# EAGLE design ADDER_auto (EAGLE 9.6.2)
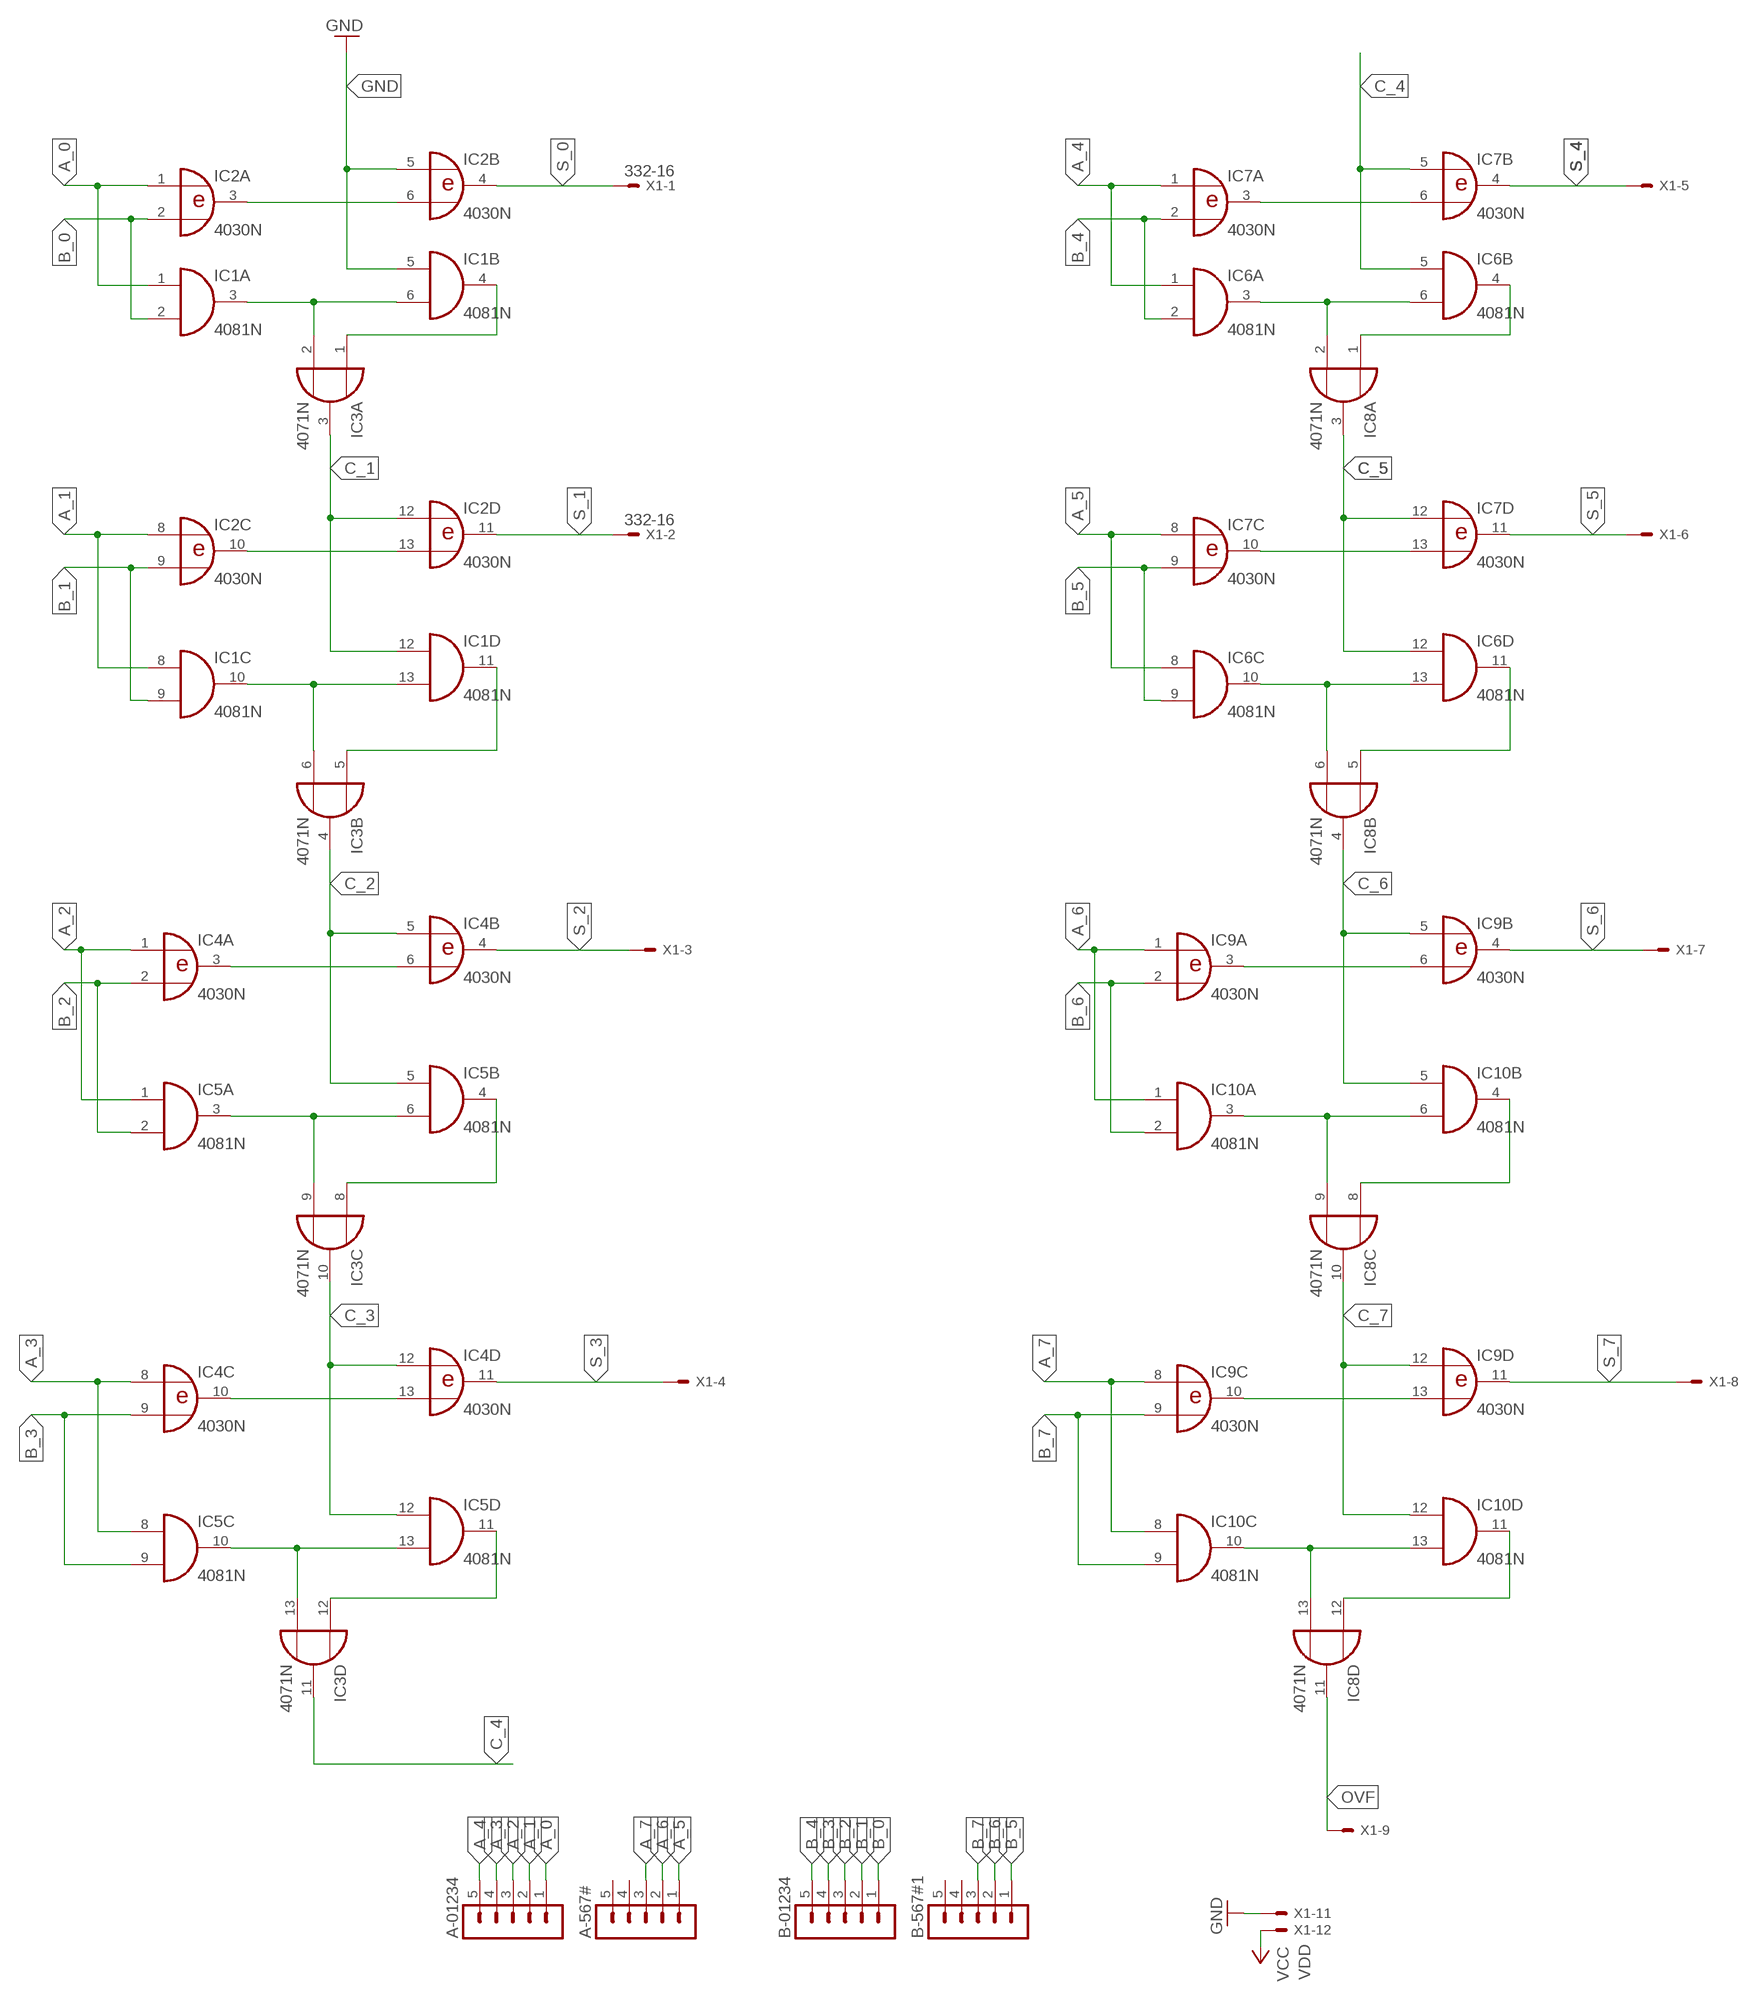
[diagram p0: schematic, sheet 1]

## Parts
A-567#  MA05-1  [MA05-1]
A-01234  MA05-1  [MA05-1]
B-567#1  MA05-1  [MA05-1]
B-01234  MA05-1  [MA05-1]
IC1  4081N  [DIL14]
IC2  4030N  [DIL14]
IC3  4071N  [DIL14]
IC4  4030N  [DIL14]
IC5  4081N  [DIL14]
IC6  4081N  [DIL14]
IC7  4030N  [DIL14]
IC8  4071N  [DIL14]
IC9  4030N  [DIL14]
IC10  4081N  [DIL14]
X1  332-16  [332-16]

## Nets
A_0: A-01234.1 IC1.1(A:I0) IC2.1(A:I0)
A_1: A-01234.2 IC1.8(C:I0) IC2.8(C:I0)
A_2: A-01234.3 IC4.1(A:I0) IC5.1(A:I0)
A_3: A-01234.4 IC4.8(C:I0) IC5.8(C:I0)
A_4: A-01234.5 IC6.1(A:I0) IC7.1(A:I0)
A_5: A-567#.1 IC6.8(C:I0) IC7.8(C:I0)
A_6: A-567#.2 IC9.1(A:I0) IC10.1(A:I0)
A_7: A-567#.3 IC9.8(C:I0) IC10.8(C:I0)
B_0: B-01234.1 IC1.2(A:I1) IC2.2(A:I1)
B_1: B-01234.2 IC1.9(C:I1) IC2.9(C:I1)
B_2: B-01234.3 IC4.2(A:I1) IC5.2(A:I1)
B_3: B-01234.4 IC4.9(C:I1) IC5.9(C:I1)
B_4: B-01234.5 IC6.2(A:I1) IC7.2(A:I1)
B_5: B-567#1.1 IC6.9(C:I1) IC7.9(C:I1)
B_6: B-567#1.2 IC9.2(A:I1) IC10.2(A:I1)
B_7: B-567#1.3 IC9.9(C:I1) IC10.9(C:I1)
C_1: IC1.12(D:I0) IC2.12(D:I0) IC3.3(A:O)
C_2: IC3.4(B:O) IC4.5(B:I0) IC5.5(B:I0)
C_3: IC3.10(C:O) IC4.12(D:I0) IC5.12(D:I0)
C_4: IC3.11(D:O) IC6.5(B:I0) IC7.5(B:I0)
C_5: IC6.12(D:I0) IC7.12(D:I0) IC8.3(A:O)
C_6: IC8.4(B:O) IC9.5(B:I0) IC10.5(B:I0)
C_7: IC8.10(C:O) IC9.12(D:I0) IC10.12(D:I0)
GND: IC1.5(B:I0) IC2.5(B:I0) X1.11
N$1: IC1.3(A:O) IC1.6(B:I1) IC3.2(A:I1)
N$2: IC1.4(B:O) IC3.1(A:I0)
N$3: IC2.10(C:O) IC2.13(D:I1)
N$4: IC4.3(A:O) IC4.6(B:I1)
N$5: IC2.3(A:O) IC2.6(B:I1)
N$6: IC1.10(C:O) IC1.13(D:I1) IC3.6(B:I1)
N$7: IC1.11(D:O) IC3.5(B:I0)
N$8: IC3.13(D:I1) IC5.10(C:O) IC5.13(D:I1)
N$9: IC3.9(C:I1) IC5.3(A:O) IC5.6(B:I1)
N$10: IC6.3(A:O) IC6.6(B:I1) IC8.2(A:I1)
N$11: IC3.12(D:I0) IC5.11(D:O)
N$12: IC4.10(C:O) IC4.13(D:I1)
N$13: IC3.8(C:I0) IC5.4(B:O)
N$14: IC6.4(B:O) IC8.1(A:I0)
N$15: IC7.3(A:O) IC7.6(B:I1)
N$16: IC7.10(C:O) IC7.13(D:I1)
N$17: IC6.10(C:O) IC6.13(D:I1) IC8.6(B:I1)
N$18: IC6.11(D:O) IC8.5(B:I0)
N$19: IC9.3(A:O) IC9.6(B:I1)
N$20: IC8.9(C:I1) IC10.3(A:O) IC10.6(B:I1)
N$21: IC8.8(C:I0) IC10.4(B:O)
N$22: IC8.13(D:I1) IC10.10(C:O) IC10.13(D:I1)
N$23: IC9.10(C:O) IC9.13(D:I1)
N$24: IC8.12(D:I0) IC10.11(D:O)
OVF: IC8.11(D:O) X1.9
S_0: IC2.4(B:O) X1.1
S_1: IC2.11(D:O) X1.2
S_2: IC4.4(B:O) X1.3
S_3: IC4.11(D:O) X1.4
S_4: IC7.4(B:O) X1.5
S_5: IC7.11(D:O) X1.6
S_6: IC9.4(B:O) X1.7
S_7: IC9.11(D:O) X1.8
VDD: X1.12 ; supply symbol labelled VCC
Unconnected: A-567#.4 A-567#.5 B-567#1.4 B-567#1.5 X1.10 X1.13 X1.14 X1.15 X1.16

## Power pins joined to a net without a drawn wire
VDD: IC1.14(P:VDD) IC2.14(P:VDD) IC3.14(P:VDD) IC4.14(P:VDD) IC5.14(P:VDD) IC6.14(P:VDD) IC7.14(P:VDD) IC8.14(P:VDD) IC9.14(P:VDD) IC10.14(P:VDD)
VSS: IC1.7(P:VSS) IC2.7(P:VSS) IC3.7(P:VSS) IC4.7(P:VSS) IC5.7(P:VSS) IC6.7(P:VSS) IC7.7(P:VSS) IC8.7(P:VSS) IC9.7(P:VSS) IC10.7(P:VSS)

## Library data of the parts
A-567# A-01234 B-567#1 B-01234 = con-lstb:MA05-1: PIN HEADER; OC_FARNELL: unknown; OC_NEWARK: unknown
IC1 IC5 IC6 IC10 = 40xx:4081: Quad 2-input AND
IC2 IC4 IC7 IC9 = 40xx:4030: Quad XOR
IC3 IC8 = 40xx:4071: Quad 2-input OR
X1 = con-garry:332-16: 16 Pin - 2mm Dual Row Source: www.mpe-connector.de / garry_shortform_2012.pdf

## Board
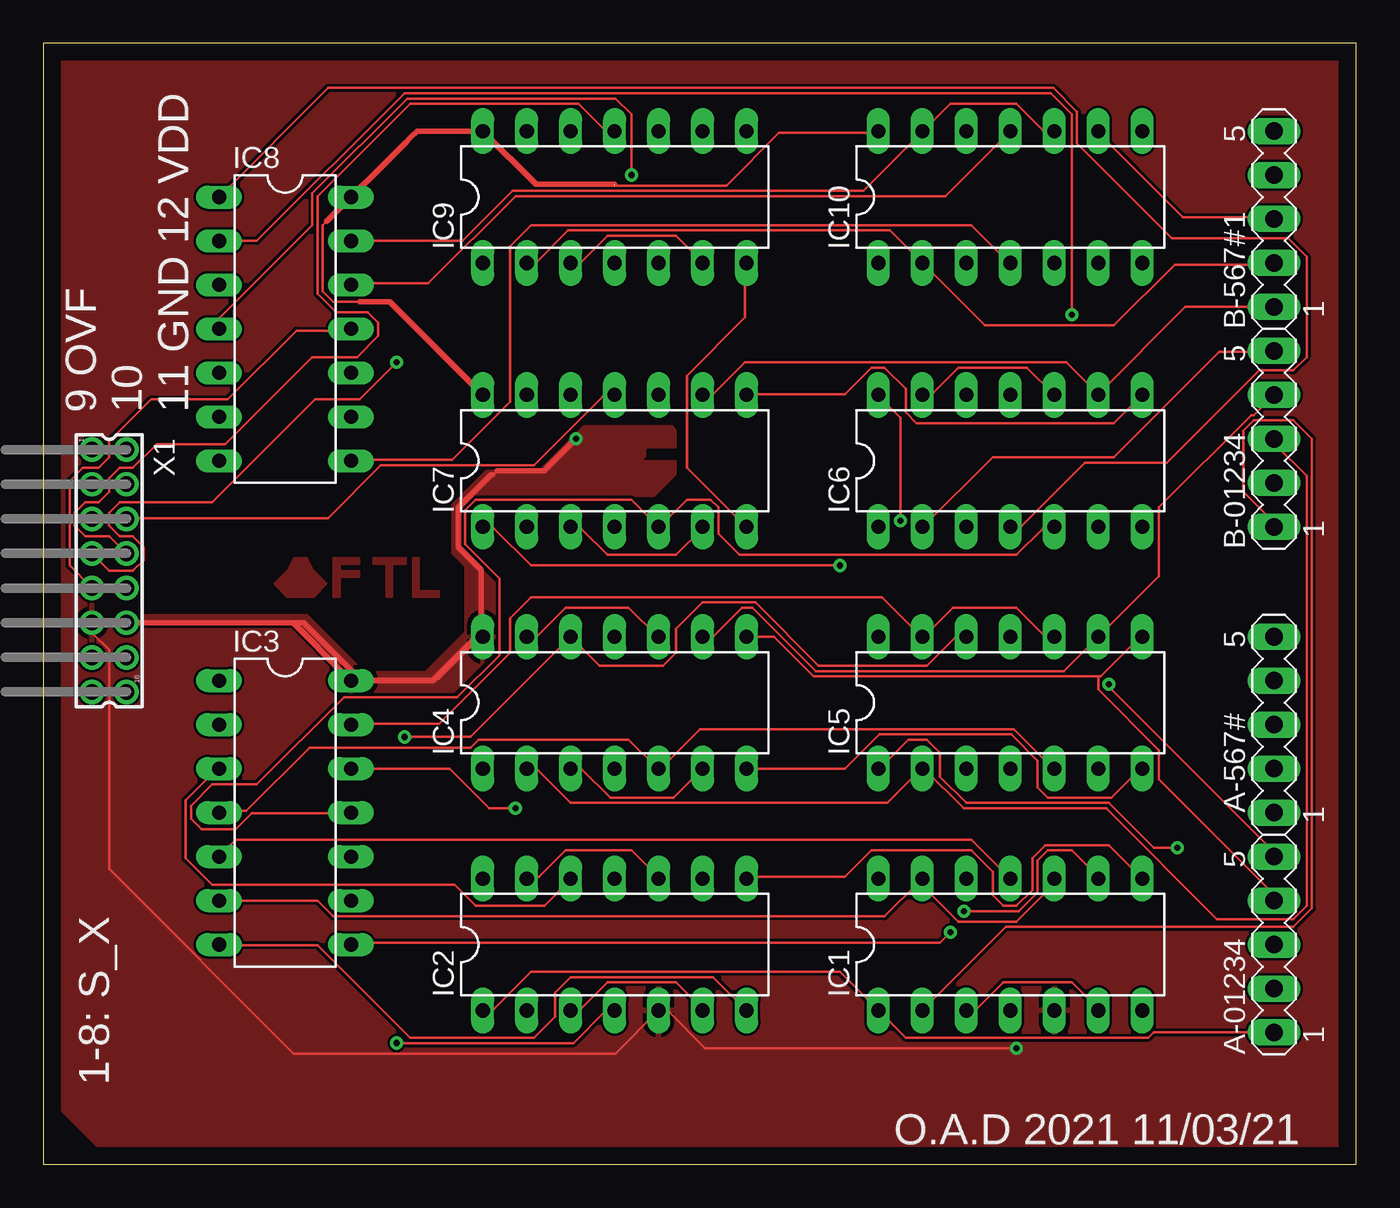
[diagram p1: board, top side]
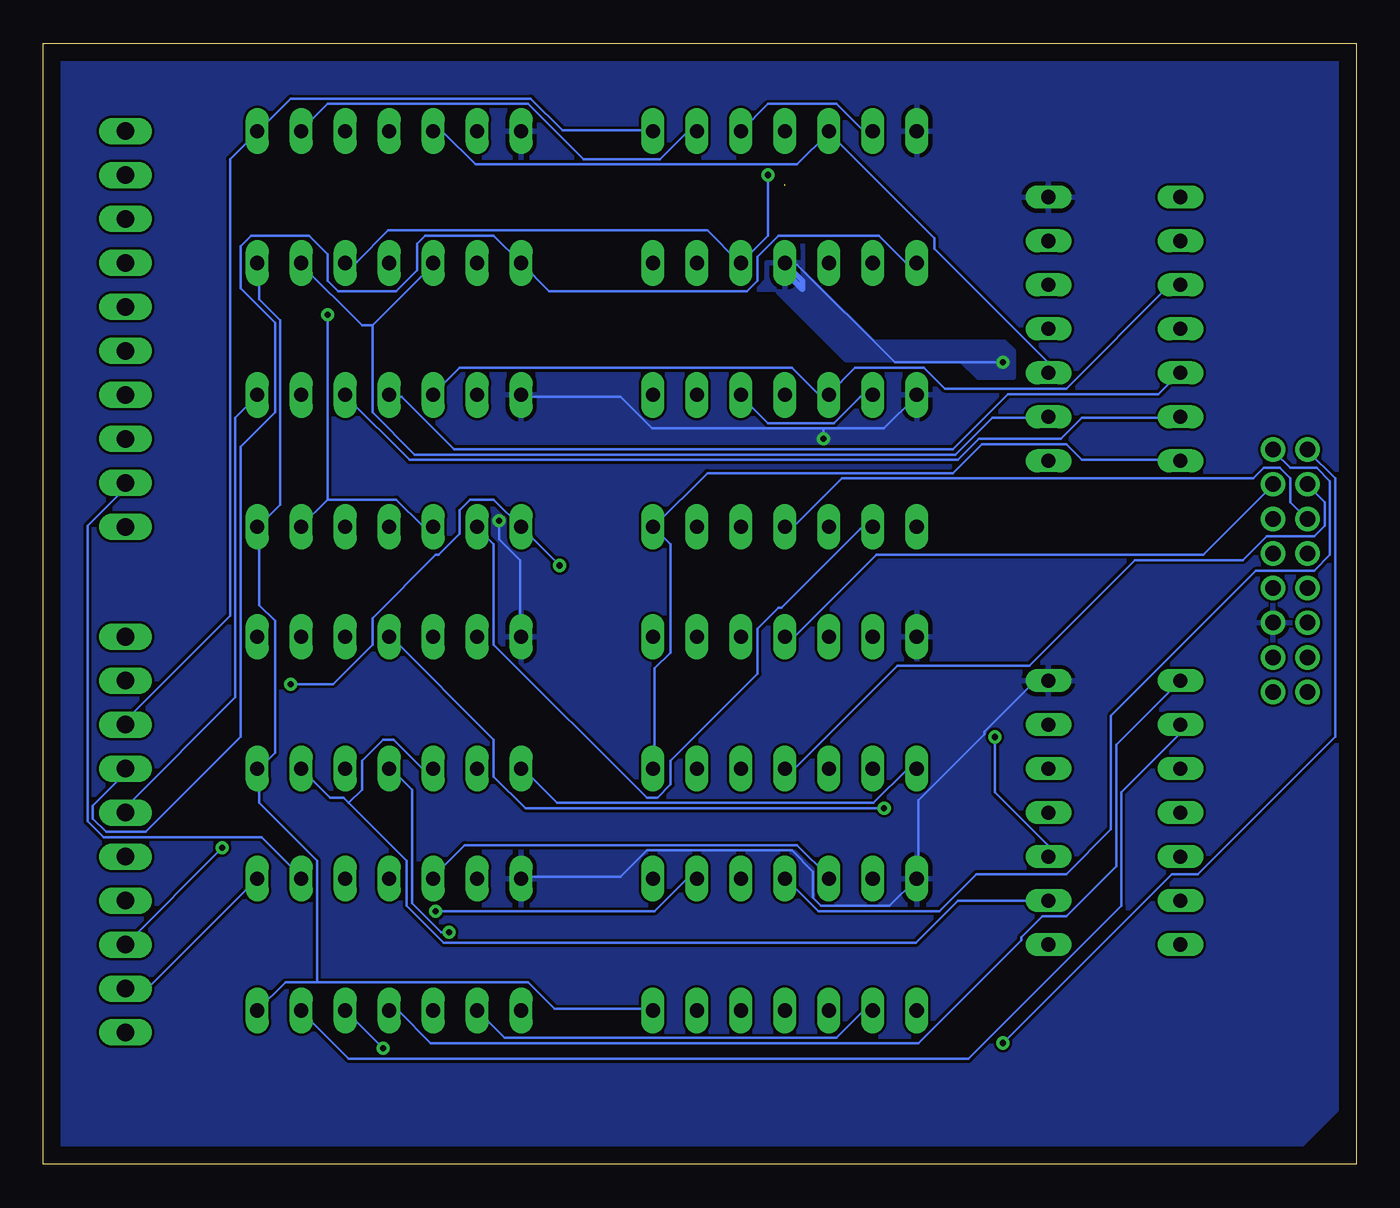
[diagram p2: board, bottom side, seen from below]

Size 75.87 x 64.76 mm. Coordinates in mm from the lower left corner, seen from the top.
Outline: 0,0 75.87,0 75.87,64.76 0,64.76 0,0
Copper layers (1*16): Top 0.035mm / dielectric 1.5mm / Bottom 0.035mm
Design rules "default": minimum track width 6mil, minimum drill 0.35mm, track to track 6mil, track to pad 6mil, pad to pad 6mil, via to via 6mil, smd to smd 6mil, copper to edge 40mil, drill to drill 6mil, minimum pad ring 10mil, minimum via ring 8mil, stop-mask expansion 4mil, vias tented up to drill 0mil, thermal gap 10mil

### Footprints (pad centres in the part's own frame; a part is rotated, then mirrored left to right if it is on the bottom)
MA05-1 = drill 1.016 long: 1 -5.08,0; 2 -2.54,0; 3 0,0; 4 2.54,0; 5 5.08,0
DIL14 = drill 0.813 long: 1 -7.62,-3.81; 2 -5.08,-3.81; 3 -2.54,-3.81; 4 0,-3.81; 5 2.54,-3.81; 6 5.08,-3.81; 7 7.62,-3.81; 8 7.62,3.81; 9 5.08,3.81; 10 2.54,3.81; 11 0,3.81; 12 -2.54,3.81; 13 -5.08,3.81; 14 -7.62,3.81
332-16 = drill 0.9 pad 1.27: 1 -7,-1; 2 -7,1; 3 -5,-1; 4 -5,1; 5 -3,-1; 6 -3,1; 7 -1,-1; 8 -1,1; 9 1,-1; 10 1,1; 11 3,-1; 12 3,1; 13 5,-1; 14 5,1; 15 7,-1; 16 7,1

### Placement (x,y rotation side)
A-567#  71.12,25.4 90 top
A-01234  71.12,12.7 90 top
B-567#1  71.12,54.61 90 top
B-01234  71.12,41.91 90 top
IC1  55.88,12.7 0 top
IC2  33.02,12.7 0 top
IC3  13.97,20.32 270 top
IC4  33.02,26.67 0 top
IC5  55.88,26.67 0 top
IC6  55.88,40.64 0 top
IC7  33.02,40.64 0 top
IC8  13.97,48.26 270 top
IC9  33.02,55.88 0 top
IC10  55.88,55.88 0 top
X1  3.81,34.29 270 top

### Tracks (layer width: path | path; a pad name or v marks a point on that pad's centre or on a via)
A_0
  Top 0.152: IC2.1 25.45,8.99 26.06,8.99 28.19,11.12 46.03,11.12 IC1.1 49.84,7.31 63.86,7.31 64.16,7.62 A-01234.1
A_1
  Top 0.152: IC1.8 61.57,18.44 57.91,18.44 57.15,17.68 57.15,15.85 56.24,14.94 55.47,14.94 54.86,15.54 54.86,16.92 53.65,18.14 47.85,18.14 46.33,16.61 40.69,16.61 IC2.8
  Bottom 0.152: IC1.8 69.8,10.21 71.02,10.21 A-01234.2
A_2  (via drill 0.35)
  Top 0.152: v65.53,18.29 64.16,18.29 61.57,20.88 53.34,20.88 51.82,22.4 51.82,23.77 51.05,24.54 49.99,24.54 48.31,22.86 IC5.1
  Bottom 0.152: IC4.1 25.91,22.86 27.89,20.88 46.18,20.88 48.16,22.86 IC5.1 | v65.53,18.29 A-01234.3
A_3
  Top 0.152: IC4.8 42.22,30.48 44.5,28.19 60.96,28.19 | 60.96,28.19 61.11,28.19 63.4,30.48 IC5.8 | 60.96,28.19 60.96,27.43 64.46,23.93 64.46,22.25 71.02,15.7 71.02,15.24 A-01234.4
A_4  (via drill 0.35)
  Top 0.152: v46.03,34.59 28.19,34.59 26.06,36.73 25.45,36.73 IC7.1 | v61.57,27.74 61.57,27.58 71.02,18.14 71.02,17.83 A-01234.5
  Bottom 0.152: v46.03,34.59 IC6.1 49.84,38.41 51.21,38.41 51.82,37.79 51.82,36.42 53.04,35.2 53.19,35.2 56.85,31.55 56.85,30.02 59.13,27.74 v61.57,27.74
A_5
  Top 0.152: IC6.8 61.87,42.82 50.44,42.82 49.84,43.43 49.84,44.81 48.62,46.02 47.85,46.02 46.33,44.5 40.69,44.5 IC7.8
  Bottom 0.152: A-567#.1 71.02,20.42 71.02,20.73 64.77,26.98 64.77,43.13 63.55,44.35 IC6.8
A_6
  Bottom 0.152: IC9.1 25.45,52.12 26.06,52.12 27.58,53.64 33.38,53.64 34.6,52.43 34.6,51.05 35.2,50.44 46.63,50.44 IC10.1 49.84,53.64 53.8,53.64 54.25,53.19 54.25,51.66 55.47,50.44 58.83,50.44 59.44,51.05 59.44,52.58 60.5,53.64 63.86,53.64 64.46,53.03 64.46,50.6 62.48,48.62 62.48,43.43 64.46,41.45 64.46,24.69 69.95,19.2 72.24,19.2 73,19.96 73,20.73 71.17,22.55 71.17,22.86 A-567#.2
A_7
  Bottom 0.152: IC9.8 40.69,59.74 45.87,59.74 47.7,61.57 61.57,61.57 63.4,59.74 IC10.8 63.55,59.59 65.07,58.06 65.07,31.7 71.02,25.76 71.02,25.45 A-567#.3
B_0
  Top 0.152: IC1.2 55.63,13.72 72.24,13.72 73.3,14.78 73.3,41.91 72.24,42.98 69.95,42.98 69.34,42.37 69.34,38.86 71.02,37.19 71.02,36.88 B-01234.1
  Bottom 0.152: IC1.2 49.23,7.31 30.02,7.31 28.5,8.84 28.04,8.84 IC2.2
B_1  (via drill 0.35)
  Top 0.152: v53.19,14.63 56.39,14.63 57.46,15.7 57.46,17.53 58.06,18.14 59.44,18.14 60.96,16.61 IC1.9
  Bottom 0.152: v53.19,14.63 40.54,14.63 38.71,16.46 38.1,16.46 IC2.9 | B-01234.2 71.17,39.32 71.17,39.01 73.3,36.88 73.3,19.81 72.39,18.9 63.25,18.9 60.96,16.61 IC1.9
B_2
  Top 0.152: IC4.2 28.5,22.86 30.48,20.88 48.77,20.88 50.75,22.86 IC5.2 50.9,22.86 53.19,20.57 61.42,20.57 67.82,14.17 72.24,14.17 73,14.94 73,39.78 71.17,41.6 71.17,41.91 B-01234.3
B_3
  Top 0.152: IC4.9 38.71,30.48 40.39,32.16 41,32.16 44.65,28.5 58.98,28.5 IC5.9 64.46,33.98 64.46,37.95 69.8,43.28 69.95,43.28 B-01234.4
B_4
  Top 0.152: B-01234.5 71.02,46.94 67.97,46.94 61.87,40.84 54.86,40.84 50.9,36.88 IC6.2
  Bottom 0.152: IC7.2 28.04,36.73 28.65,36.73 33.22,32.16 33.38,32.16 34.6,30.94 34.6,28.35 39.62,23.32 39.62,21.95 40.39,21.18 41,21.18 49.84,30.02 49.84,35.81 50.75,36.73 IC6.2
B_5
  Top 0.152: 60.96,44.5 59.13,46.33 40.54,46.33 38.71,44.5 38.1,44.5 IC7.9 | B-567#1.1 65.99,49.53 60.96,44.5 | 60.96,44.5 IC6.9
B_6
  Top 0.152: IC9.2 28.04,52.12 28.5,52.12 30.33,53.95 48.92,53.95 IC10.2 54.41,48.46 61.87,48.46 65.38,51.97 71.02,51.97 B-567#1.2
B_7
  Top 0.152: B-567#1.3 71.02,54.71 65.84,54.71 60.96,59.59 IC10.9
  Bottom 0.152: IC9.9 38.1,59.59 38.71,59.59 40.23,58.06 44.65,58.06 47.85,61.27 59.44,61.27 60.96,59.74 IC10.9
C_1
  Top 0.152: IC3.3 10.06,22.86 8.23,21.03 8.23,17.68 9.75,16.15 23.77,16.15 24.99,14.94 28.96,14.94 30.48,16.46 IC2.12
  Bottom 0.152: IC2.12 30.48,16.61 32.31,18.44 51.51,18.44 53.34,16.61 IC1.12
C_2
  Top 0.152: IC3.4 10.21,20.42 11.73,20.42 15.39,24.08 24.69,24.08 25.15,24.54 33.83,24.54 35.51,22.86 IC4.5 35.66,22.86 37.95,25.15 56.08,25.15 58.37,22.86 IC5.5
C_3  (via drill 0.35)
  Top 0.152: v20.88,24.69 24.69,24.69 IC4.12 32.16,28.8 35.81,28.8 36.58,29.57 36.58,30.94 38.1,32.46 41.15,32.46 44.81,28.8 51.05,28.8 52.73,30.48 IC5.12
  Bottom 0.152: v20.88,24.69 20.88,21.49 17.83,18.44 17.83,17.83 IC3.10
C_4
  Top 0.152: IC3.11 17.68,20.27 12.04,20.27 11.12,19.36 9.14,19.36 8.53,19.96 8.53,20.73 9.75,21.95 12.34,21.95 17.37,26.98 23.93,26.98 26.36,29.41 26.36,33.83 24.38,35.81 24.38,37.79 24.99,38.41 33.98,38.41 IC7.5 35.66,36.88 37.19,38.41 38.56,38.41 39.01,37.95 39.01,36.42 40.23,35.2 56.24,35.2 57.76,36.73 58.37,36.73 IC6.5
C_5
  Bottom 0.152: 30.48,44.5 31.09,44.5 32.61,46.02 51.82,46.02 53.34,44.5 IC6.12 | 30.48,44.5 28.96,46.02 24.99,46.02 23.77,44.81 16.76,44.81 10.82,50.75 10.21,50.75 IC8.3 | 30.48,44.5 IC7.12
C_6  (via drill 0.35)
  Top 0.152: v33.98,57.15 33.98,60.66 33.07,61.57 21.03,61.57 15.54,56.08 15.54,54.25 10.21,48.92 10.21,48.31 IC8.4
  Bottom 0.152: v33.98,57.15 33.98,53.64 IC9.5 35.66,52.12 37.49,53.95 55.93,53.95 57.76,52.12 58.37,52.12 IC10.5
C_7
  Bottom 0.152: 30.48,59.59 24.38,53.49 24.38,52.88 17.83,46.33 17.83,45.72 IC8.10 | 30.48,59.59 32.31,57.76 50.9,57.76 52.73,59.59 53.34,59.59 IC10.12 | 30.48,59.59 IC9.12
GND  (via drill 0.35)
  Top 0.152: v56.24,6.71 38.25,6.71 36.12,8.84 35.66,8.84 IC2.5 33.07,6.4 14.48,6.4 3.81,17.07 3.81,29.72 2.9,30.63 2.9,31.24 X1.11
  Bottom 0.152: IC1.5 v56.24,6.71
  pour Top: 0.51,64.26 0.51,3.81 4.06,0.25 76.2,0.25 76.2,64.26
N$1
  Top 0.152: IC1.3 53.34,8.99 53.95,8.99 55.47,10.52 59.44,10.52 60.96,8.99 IC1.6
  Bottom 0.152: IC3.2 10.21,25.3 10.21,24.84 13.56,21.49 13.56,14.94 22.4,6.1 58.22,6.1 60.96,8.84 IC1.6
N$2
  Bottom 0.152: IC3.1 13.87,24.23 13.87,17.22 16.76,14.33 18.14,14.33 19.36,13.11 19.36,12.95 25.3,7.01 53.49,7.01 55.32,8.84 55.78,8.84 IC1.4
N$3
  Top 0.152: IC2.13 28.04,16.61 28.65,16.61 30.18,18.14 33.98,18.14 35.51,16.61 IC2.10
N$4
  Top 0.152: IC4.3 31.09,22.86 32.77,21.18 36.42,21.18 IC4.6
N$5
  Top 0.152: IC2.3 30.48,8.99 31.09,8.99 32.61,10.52 36.58,10.52 38.1,8.99 IC2.6
N$6
  Top 0.152: IC3.6 15.85,15.24 16.76,14.33 48.62,14.33 50.6,16.31 | 50.6,16.31 IC1.13 50.75,16.46 | 50.6,16.31 52.88,14.02 56.24,14.02 58.37,16.15 58.37,16.46 IC1.10
N$7
  Top 0.152: IC1.11 53.65,18.75 11.12,18.75 IC3.5
N$8
  Top 0.152: IC3.13 17.83,25.45 22.86,25.45 26.97,29.57 26.97,31.55 28.19,32.77 48.46,32.77 50.75,30.48 IC5.13 50.9,30.48 52.58,32.16 56.24,32.16 57.91,30.48 IC5.10
N$9
  Bottom 0.152: IC3.9 23.01,15.24 25.45,12.8 52.73,12.8 54.86,14.94 54.86,17.53 58.22,20.88 | 58.22,20.88 58.52,21.18 59.28,21.18 IC5.6 | IC5.3 53.95,22.86 55.63,24.54 56.24,24.54 57.46,23.32 57.46,21.64 58.22,20.88
N$10  (via drill 0.35)
  Top 0.152: IC8.2 12.34,53.34 20.88,61.87 58.22,61.87 59.44,60.66 v59.44,49.07
  Bottom 0.152: 59.44,38.41 v59.44,49.07 | 59.44,38.41 60.96,36.88 IC6.6 | 59.44,38.41 55.47,38.41 53.95,36.88 53.34,36.88 IC6.3
N$11  (via drill 0.35)
  Top 0.152: IC3.12 23.47,22.86 25.76,20.57 v27.28,20.57
  Bottom 0.152: v27.28,20.57 48.01,20.57 49.84,22.4 49.84,24.54 55.78,30.48 IC5.11
N$12
  Top 0.152: IC4.13 28.5,30.48 30.18,32.16 33.83,32.16 35.51,30.48 IC4.10
N$13  (via drill 0.35)
  Top 0.152: v52.43,13.41 51.82,12.8 17.83,12.8 IC3.8
  Bottom 0.152: v52.43,13.41 52.88,13.41 54.56,15.09 54.56,21.64 55.78,22.86 IC5.4
N$14
  Top 0.152: IC8.1 16.46,62.18 58.37,62.18 59.74,60.81 59.74,58.98 65.23,53.49 71.93,53.49 73,52.43 73,46.63 72.24,45.87 70.26,45.87 64.92,40.54 60.2,40.54 56.54,36.88 55.93,36.88 IC6.4
N$15
  Top 0.152: IC7.3 30.48,36.73 31.09,36.73 32.61,35.2 36.58,35.2 38.1,36.73 IC7.6
N$16
  Bottom 0.152: IC7.13 28.04,44.35 28.65,44.35 30.18,42.82 33.98,42.82 35.51,44.35 IC7.10
N$17
  Top 0.152: IC6.10 56.85,46.02 52.88,46.02 51.36,44.5 50.9,44.5 IC6.13
  Bottom 0.152: IC8.6 10.21,43.13 15.85,43.13 17.07,41.91 21.79,41.91 23.01,40.69 54.71,40.69 58.37,44.35 IC6.10
N$18
  Bottom 0.152: IC6.11 55.78,44.35 55.17,44.35 52.12,41.3 23.32,41.3 20.12,44.5 11.43,44.5 10.21,45.72 IC8.5
N$19
  Top 0.152: IC9.3 30.48,52.12 31.09,52.12 32.61,53.64 36.58,53.64 38.1,52.12 IC9.6
N$20
  Bottom 0.152: 56.85,48.46 56.85,43.43 54.41,41 23.16,41 21.03,43.13 17.83,43.13 IC8.9 | 56.85,48.46 53.34,51.97 IC10.3 | 56.85,48.46 57.46,48.46 60.96,51.97 IC10.6
N$21
  Top 0.152: IC8.8 17.83,40.69 23.62,40.69 26.97,44.04 26.97,53.03 28.19,54.25 53.65,54.25 55.78,52.12 IC10.4
N$22
  Top 0.152: IC8.13 24.23,53.34 27.13,56.24 47.4,56.24 50.75,59.59 IC10.13 50.9,59.74 52.43,61.27 56.24,61.27 57.76,59.74 58.37,59.74 IC10.10
N$23
  Bottom 0.152: IC9.10 33.98,61.27 30.02,61.27 28.5,59.74 28.04,59.74 IC9.13
N$24
  Top 0.152: IC10.11 52.12,55.93 27.28,55.93 22.25,50.9 17.83,50.9 IC8.12
N$25
  pour Top: 14.86,32.77 15.62,32.77 16.38,33.53 15.62,34.29 14.86,34.29 14.1,33.53
N$26
  pour Top: 14.86,32.77 14.1,32.77 13.33,33.53 14.1,34.29 14.86,34.29 15.62,33.53
N$27
  pour Top: 14.48,33.53 15.24,33.53 15.62,34.29 15.24,35.05 14.48,35.05 14.1,34.29
N$28
  pour Top: 16.76,32.77 16.76,35.05 18.29,35.05 18.29,34.67 17.14,34.67 17.14,34.29 18.29,34.29 18.29,33.91 17.14,33.91 17.14,32.77
N$29
  pour Top: 19.05,35.05 19.05,34.67 19.43,34.67 19.81,34.67 19.81,32.77 20.19,32.77 20.19,34.67 20.95,34.67 20.95,35.05
N$30
  pour Top: 21.34,35.05 21.34,32.77 22.86,32.77 22.86,33.15 21.72,33.15 21.72,35.05
OVF
  Top 0.152: IC8.11 17.68,48.16 14.63,48.16 10.67,44.2 6.25,44.2 3.81,41.76 3.81,40.84 3.2,40.23 2.29,40.23 1.52,39.47 1.52,34.59 2.74,33.38 X1.9
S_0  (via drill 0.35)
  Top 0.152: v20.42,7.01 30.63,7.01 32.46,8.84 32.92,8.84 IC2.4
  Bottom 0.152: v20.42,7.01 10.67,16.76 9.14,16.76 1.22,24.69 1.22,39.62 2.74,41.15 X1.1
S_1
  Bottom 0.152: IC2.11 32.92,16.46 31.09,14.63 24.08,14.63 21.95,16.76 16.76,16.76 14.17,19.36 14.17,25.91 5.79,34.29 2.44,34.29 1.52,35.2 1.52,39.47 2.29,40.23 3.81,40.23 4.72,41.15 X1.2
S_2
  Bottom 0.152: IC4.4 32.46,22.86 26.52,28.8 18.9,28.8 12.8,34.9 6.55,34.9 5.18,36.27 2.44,36.27 1.83,36.88 1.83,38.25 2.74,39.17 X1.3
S_3
  Bottom 0.152: IC4.11 32.46,30.48 27.74,35.2 8.84,35.2 4.88,39.17 X1.4
S_4
  Bottom 0.152: IC7.4 32.92,36.88 32.46,36.88 29.72,39.62 5.94,39.62 5.33,40.23 4.42,40.23 3.81,39.62 3.81,38.25 2.9,37.34 X1.5
S_5
  Top 0.152: IC7.11 32.92,44.35 32.31,44.35 28.35,40.39 19.51,40.39 16.46,37.34 4.88,37.34 X1.6
S_6  (via drill 0.35)
  Top 0.152: v20.42,46.33 18.29,44.2 15.7,44.2 9.75,38.25 4.42,38.25 3.81,37.64 3.81,36.88 4.42,36.27 5.18,36.27 5.79,35.66 5.79,34.9 5.18,34.29 3.81,34.29 X1.7
  Bottom 0.152: v20.42,46.33 26.67,46.33 32.31,51.97 32.92,51.97 IC9.4
  Bottom 0.305: IC9.4 32,51.05 32,50.55 33.02,51.56 IC9.4
  pour Bottom: 32,53.09 32,51.56 31.5,51.05 27.94,47.5 20.32,47.5 19.81,46.99 19.81,45.47 21.84,45.47 22.86,46.48 29.46,46.48 33.53,50.55 34.54,50.55 34.04,51.05 34.04,52.07 33.02,53.09
S_7
  Top 0.152: IC9.11 32.92,59.74 32.46,59.74 30.94,61.27 21.18,61.27 15.85,55.93 15.85,50.29 16.92,49.22 18.74,49.22 19.36,48.62 19.36,47.85 18.14,46.63 15.54,46.63 10.52,41.6 6.55,41.6 5.18,40.23 4.42,40.23 3.81,39.62 3.81,38.86 3.2,38.25 2.44,38.25 1.83,37.64 1.83,36.88 2.44,36.27 3.81,36.27 4.72,35.36 X1.8
VDD  (via drill 0.35)  (1 unrouted)
  Top 0.152: 25.3,30.48 22.86,28.04 18.29,28.04 17.83,28.04 IC3.14 17.4,28.32 | v49.53,37.19 49.53,43.13 48.31,44.35 IC6.14 | 18.29,49.84 16.76,49.84 16.15,50.44 16.15,54.25 16.38,54.48 IC8.14 20.95,59.05 | 33.02,56.54 39.47,56.54 42.52,59.59 48.16,59.59 IC10.14 | 25.3,34.29 25.3,30.73 25.3,30.48 | 24.08,35.81 24.08,37.95 25.96,39.83 26.21,40.08 | 28.96,40.08 29.11,40.23 | 25.3,30.48 IC4.14 | 7.11,31.29 14.43,31.29
  Top 0.305: 17.4,28.32 14.43,31.29 X1.12 7.11,31.29 15.04,31.29 18.29,28.04 | IC3.14 22.5,27.94 25.3,30.73 | IC4.14 25.3,30.58 25.3,34.29 25.3,34.36 24,35.66 24,37.95 25.88,39.83 25.96,39.83 | 26.21,40.08 28.96,40.08 | 29.11,40.23 v30.79,41.91 | IC7.14 20.02,49.84 18.29,49.84 | 16.38,54.48 20.95,59.05 21.21,59.31 21.59,59.69 IC9.14 28.47,56.62 33.02,56.62
  Bottom 0.152: IC3.14 17.83,27.89 18.59,27.89 21.49,24.99 21.49,24.84 25.3,21.03 25.3,16.61 IC2.14 26.97,14.94 30.94,14.94 31.39,15.39 31.39,16.92 32.61,18.14 41,18.14 42.52,16.61 48.16,16.61 IC1.14 | v49.53,37.19 49.53,36.12 48.31,34.9 48.31,30.48 IC5.14 | 30.79,42.52 27.28,42.52 25.45,44.35 IC7.14 | 30.79,42.52 40.69,42.52 42.52,44.35 48.16,44.35 IC6.14 | 30.79,42.52 v30.79,41.91
  pour Bottom: 0.51,64.26 0.51,3.81 4.06,0.25 76.2,0.25 76.2,64.26
  pour Top: 5.59,31.24 14.48,31.24 17.27,28.45 17.27,27.18 23.62,27.18 26.16,29.72 26.16,33.53 24.64,35.05 24.13,35.56 24.13,35.81 24.13,37.85 24.89,38.61 34.29,38.61 35.31,38.61 36.58,39.88 36.58,40.64 34.54,40.64 34.8,40.89 34.8,41.4 36.58,41.4 36.58,42.42 36.32,42.67 31.24,42.67 28.7,40.13 25.65,40.13 23.62,38.1 23.62,35.31 24.38,34.54 24.38,30.73 22.1,28.45 19.05,28.45 18.54,28.45 15.24,31.75 4.57,31.75 4.32,31.5 4.32,30.99 4.57,30.73 5.08,30.73
VSS
  Top 0.152: IC9.7 40.54,51.97 40.54,48.92 37.19,45.57 37.19,40.23 40.54,36.88 IC7.7 | IC2.7 38.71,10.82 30.48,10.82 29.57,9.91 29.57,8.53 28.35,7.31 21.18,7.31 15.85,12.65 10.21,12.65 IC3.7 | IC4.7 46.33,22.86 48.31,24.84 55.93,24.84 57.46,23.32 57.46,21.79 58.06,21.18 61.72,21.18 63.4,22.86 IC5.7
  Bottom 0.152: IC4.7 40.54,22.86 40.54,28.65 39.62,29.57 39.62,35.81 IC7.7 40.54,36.88 37.49,39.93 23.32,39.93 21.64,41.6 16.76,41.6 15.85,40.69 10.21,40.69 IC8.7 | 60.05,10.52 61.87,10.52 IC1.7 | 60.05,10.52 47.85,10.52 46.33,8.99 40.69,8.99 IC2.7 | 63.4,22.86 63.4,20.88 60.05,17.53 60.05,10.52 | 63.4,22.86 62.48,23.77 62.48,31.39 63.4,32.31 63.4,36.73 IC6.7 63.4,36.88 62.18,38.1 62.18,48.77 63.4,49.99 63.4,51.97 IC10.7 | 63.4,22.86 IC5.7

### Text on the board
tNames: 9 OVF / 10 / 11 GND 12 VDD | 1-8: S_X | O.A.D 2021 11/03/21